# EAGLE design L293DShield (EAGLE 5.09)
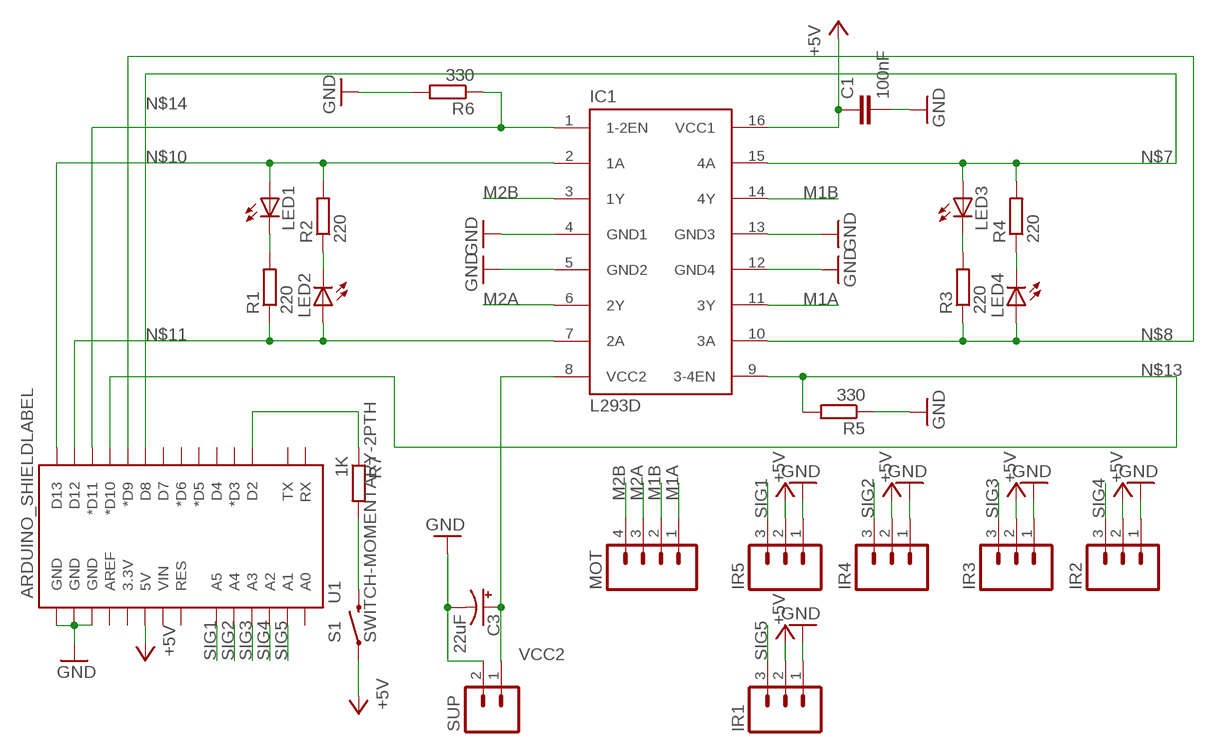
[diagram p0: schematic, sheet 1]

## Parts
C1  100nF  CAPPTH2  [CAP-PTH-SMALL2]
C3  22uF  CAP_POLPTH2  [CPOL-RADIAL-10UF-25V]
IC1  L293D  [DIL16]
IR1  M03PTH  [1X03]
IR2  M03PTH  [1X03]
IR3  M03PTH  [1X03]
IR4  M03PTH  [1X03]
IR5  M03PTH  [1X03]
LED1  LED3MM  [LED3MM]
LED2  LED3MM  [LED3MM]
LED3  LED3MM  [LED3MM]
LED4  LED3MM  [LED3MM]
MOT  M04PTH  [1X04]
R1  220  R-EU_0204/5  [0204/5]
R2  220  R-EU_0204/5  [0204/5]
R3  220  R-EU_0204/5  [0204/5]
R4  220  R-EU_0204/5  [0204/5]
R5  330  R-EU_0204/5  [0204/5]
R6  330  R-EU_0204/5  [0204/5]
R7  1K  R-EU_0204/5  [0204/5]
S1  SWITCH-MOMENTARY-2PTH  [TACTILE-PTH]
SUP  M02LOCK  [1X02_LOCK]
U1  ARDUINO_SHIELDLABEL  [DUEMILANOVE_SHIELD]

## Nets
+5V: C1.1 IC1.16(VCC1) IR1.2 IR2.2 IR3.2 IR4.2 IR5.2 S1.1 U1.5V
GND: C1.2 C3.2(-) IC1.4(GND1) IC1.5(GND2) IC1.12(GND4) IC1.13(GND3) IR1.1 IR2.1 IR3.1 IR4.1 IR5.1 R5.1 R6.2 SUP.2 U1.GND@0(GND) U1.GND@1(GND) U1.GND@2(GND)
M1A: IC1.11(3Y) MOT.1
M1B: IC1.14(4Y) MOT.2
M2A: IC1.6(2Y) MOT.3
M2B: IC1.3(1Y) MOT.4
N$1: LED1.K(C) R1.2
N$2: LED2.K(C) R2.1
N$3: LED3.K(C) R3.2
N$4: LED4.K(C) R4.1
N$5: R7.2 S1.3
N$6: R7.1 U1.D2
N$7: IC1.15(4A) LED3.A R4.2 U1.D8
N$8: IC1.10(3A) LED4.A R3.1 U1.D9(*D9)
N$10: IC1.2(1A) LED1.A R2.2 U1.D13
N$11: IC1.7(2A) LED2.A R1.1 U1.D12
N$13: IC1.9(3-4EN) R5.2 U1.D10(*D10)
N$14: IC1.1(1-2EN) R6.1 U1.D11(*D11)
SIG1: IR5.3 U1.A5
SIG2: IR4.3 U1.A4
SIG3: IR3.3 U1.A3
SIG4: IR2.3 U1.A2
SIG5: IR1.3 U1.A1
VCC2: C3.1(+) IC1.8(VCC2) SUP.1
Unconnected: U1.3.3V U1.A0 U1.AREF U1.D3(*D3) U1.D4 U1.D5(*D5) U1.D6(*D6) U1.D7 U1.RES U1.RX U1.TX U1.VIN

## Library data of the parts
C1 = SparkFun:CAP: Capacitor Standard 0603 ceramic capacitor, and 0.1" leaded capacitor.
C3 = SparkFun:CAP_POL: Capacitor Polarized These are standard SMD and PTH capacitors. Normally 10uF, 47uF, and 100uF in electrolytic and tantalum varieties. Always verify the external diameter of the through hole cap, it varies with capacity, voltage, and manufacturer. The EIA devices should be standard.
IC1 = st-microelectronics:L293D: PUSH-PULL 4 CHANNEL DRIVER
IR1-IR5 = SparkFun:M03: Header 3 Standard 3-pin 0.1" header. Use with straight break away headers (SKU : PRT-00116), right angle break away headers (PRT-00553), swiss pins (PRT-00743), machine pins (PRT-00117), and female headers (PRT-00115). Molex polarized connector foot print use with SKU : PRT-08232 with associated crimp pins and housings.
LED1-LED4 = led:LED: LED OSRAM: - CHIPLED LG R971, LG N971, LY N971, LG Q971, LY Q971, LO R971, LY R971 LH N974, LH R974 LS Q976, LO Q976, LY Q976 LO Q996 - Hyper CHIPLED LW Q18S LB Q993, LB Q99A, LB R99A - SideLED LS A670, LO A670, LY A670, LG A670, LP A670 LB A673, LV A673, LT A673, LW A673 LH A674 LY A675 LS A676, LA A676, LO A676, LY A676, LW A676 LS A679, LY A679, LG A679 - Hyper Micro SIDELED® LS Y876, LA Y876, LO Y876, LY Y876 LT Y87S - SmartLED LW L88C, LW L88S LB L89C, LB L89S, LG L890 LS L89K, LO L89K, LY L89K LS L896, LA L896, LO L896, LY L896 - TOPLED LS T670, LO T670, LY T670, LG T670, LP T670 LSG T670, LSP T670, LSY T670, LOP T670, LYG T670 LG T671, LOG T671, LSG T671 LB T673, LV T673, LT T673, LW T673 LH T674 LS T676, LA T676, LO T676, LY T676, LB T676, LH T676, LSB T676, LW T676 LB T67C, LV T67C, LT T67C, LS T67K, LO T67K, LY T67K, LW E67C LS E67B, LA E67B, LO E67B, LY E67B, LB E67C, LV E67C, LT E67C LW T67C LS T679, LY T679, LG T679 LS T770, LO T770, LY T770, LG T770, LP T770 LB T773, LV T773, LT T773, LW T773 LH T774 LS E675, LA E675, LY E675, LS T675 LS T776, LA T776, LO T776, LY T776, LB T776 LHGB T686 LT T68C, LB T68C - Hyper Mini TOPLED® LB M676 - Mini TOPLED Santana® LG M470 LS M47K, LO M47K, LY M47K Source: http://www.osram.convergy.de LUXEON: - LUMILED® LXK2-PW12-R00, LXK2-PW12-S00, LXK2-PW14-U00, LXK2-PW14-V00 LXK2-PM12-R00, LXK2-PM12-S00, LXK2-PM14-U00 LXK2-PE12-Q00, LXK2-PE12-R00, LXK2-PE12-S00, LXK2-PE14-T00, LXK2-PE14-U00 LXK2-PB12-K00, LXK2-PB12-L00, LXK2-PB12-M00, LXK2-PB14-N00, LXK2-PB14-P00, LXK2-PB14-Q00 LXK2-PR12-L00, LXK2-PR12-M00, LXK2-PR14-Q00, LXK2-PR14-R00 LXK2-PD12-Q00, LXK2-PD12-R00, LXK2-PD12-S00 LXK2-PH12-R00, LXK2-PH12-S00 LXK2-PL12-P00, LXK2-PL12-Q00, LXK2-PL12-R00 Source: www.luxeon.com KINGBRIGHT: KA-3528ASYC Source: www.kingbright.com
MOT = SparkFun:M04: Header 4 Standard 4-pin 0.1" header. Use with straight break away headers (SKU : PRT-00116), right angle break away headers (PRT-00553), swiss pins (PRT-00743), machine pins (PRT-00117), and female headers (PRT-00115). Molex polarized connector foot print use with SKU : PRT-08231 with associated crimp pins and housings.
R1-R7 = resistor:R-EU_: RESISTOR, European symbol
S1 = SparkFun:SWITCH-MOMENTARY-2
SUP = SparkFun:M02: Header 2 Standard 2-pin 0.1" header. Use with straight break away headers (SKU : PRT-00116), right angle break away headers (PRT-00553), swiss pins (PRT-00743), machine pins (PRT-00117), and female headers (PRT-00115). Molex polarized connector foot print use with SKU : PRT-08233 with associated crimp pins and housings.
U1 = SparkFun:ARDUINO_SHIELD

## Board
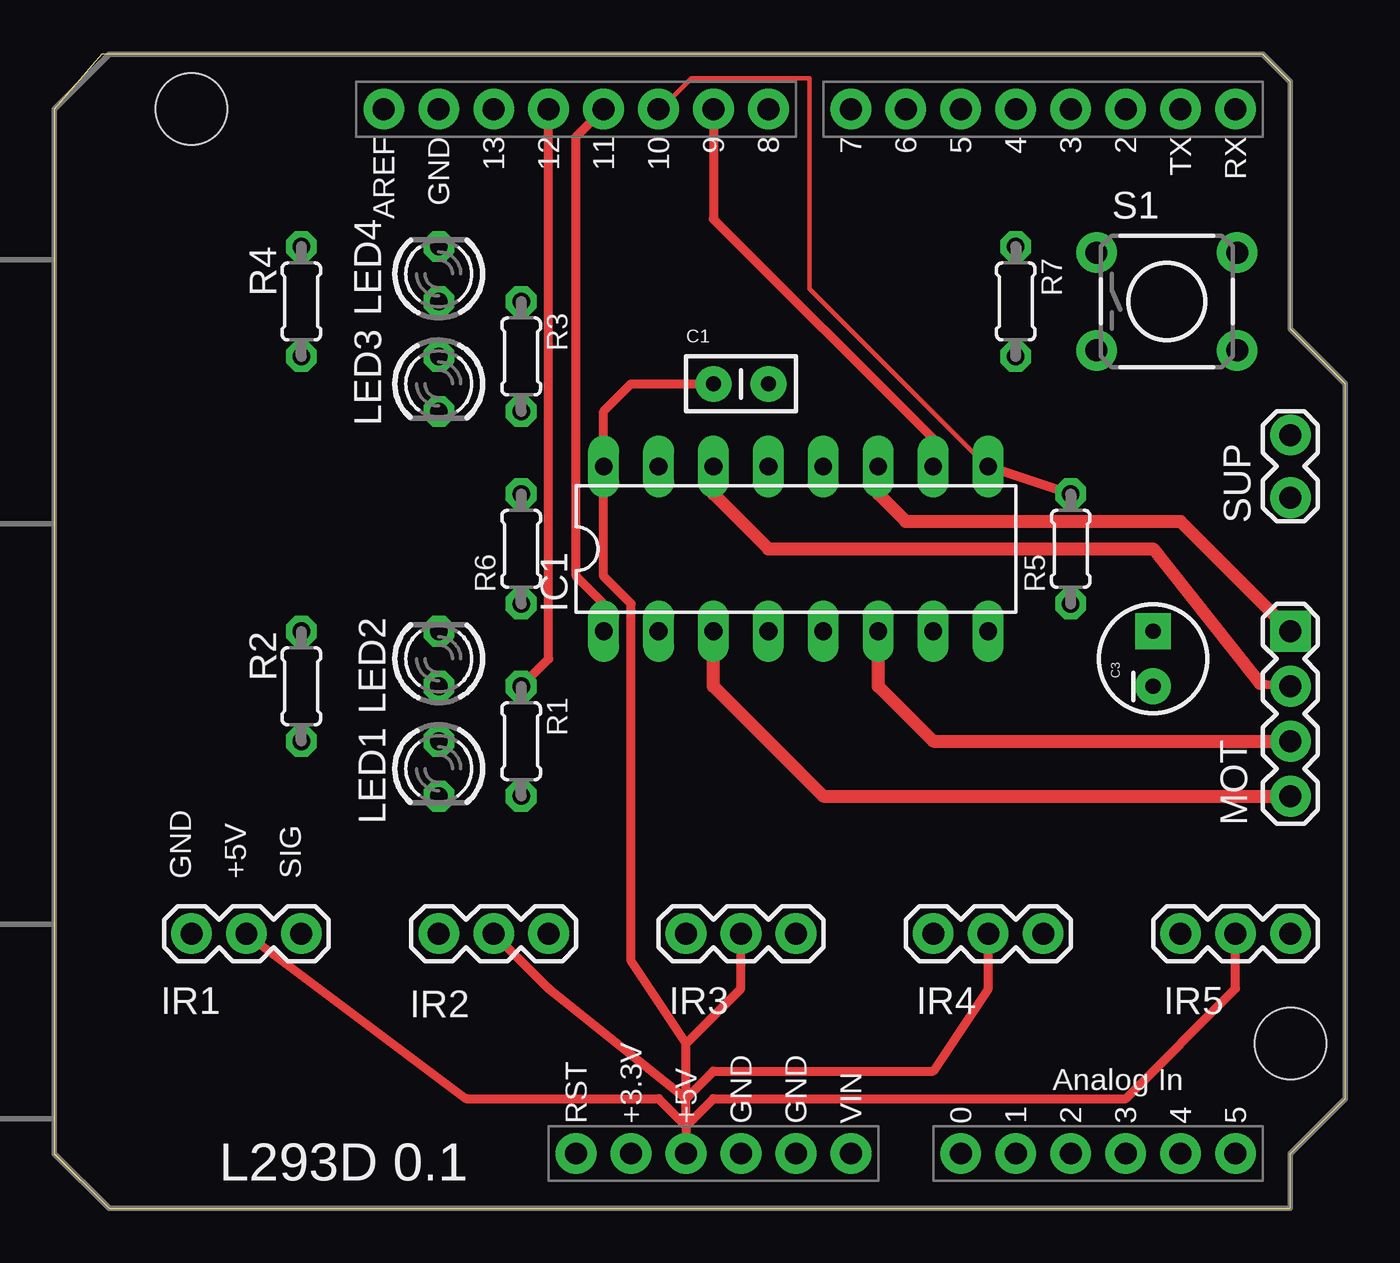
[diagram p1: board, top side]
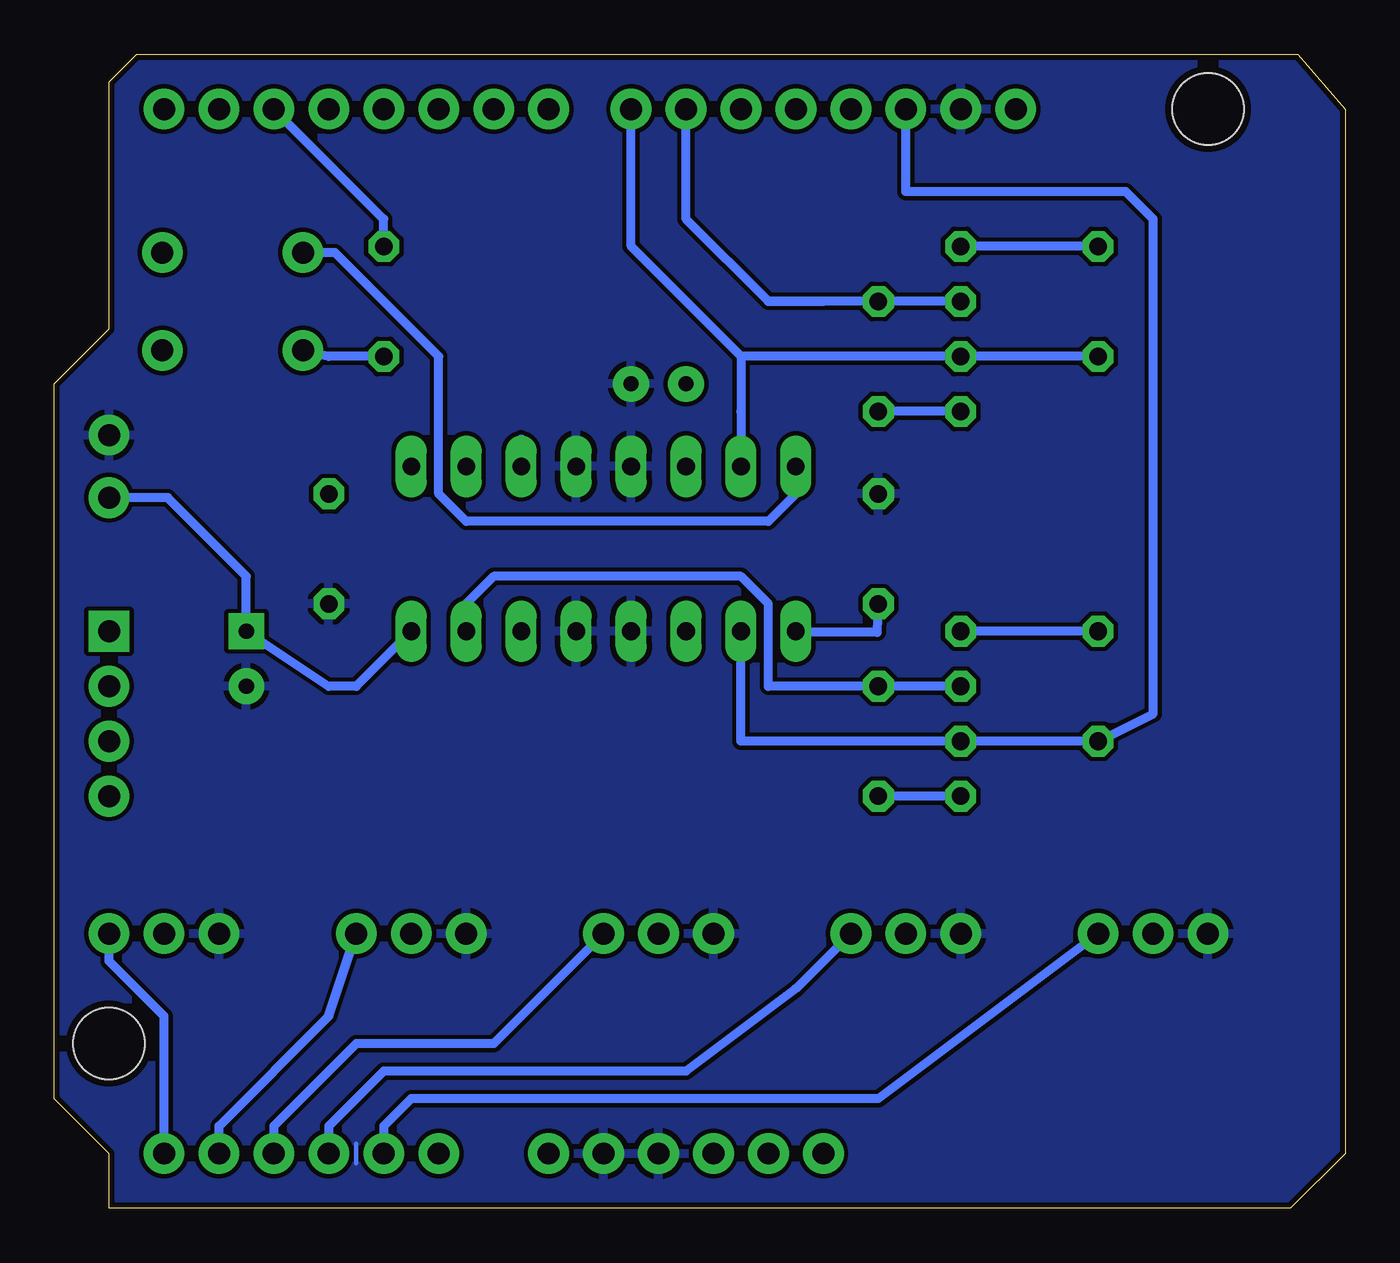
[diagram p2: board, bottom side, seen from below]

Size 59.69 x 53.34 mm. Coordinates in mm from the lower left corner, seen from the top.
Outline: 0,2.54 2.54,0 57.15,0 57.15,2.54 59.69,5.08 59.69,38.1 57.15,40.64 57.15,52.07 55.88,53.34 54.28,53.34 2.21,53.33 0,50.79 0,2.54
Copper layers (1*16): Top 0.035mm / dielectric 1.5mm / Bottom 0.035mm
Design rules "SparkFun": minimum track width 8mil, minimum drill 20mil, track to track 8mil, track to pad 8mil, pad to pad 8mil, via to via 8mil, smd to smd 8mil, copper to edge 10mil, drill to drill 8mil, minimum pad ring 12mil, minimum via ring 10mil, stop-mask expansion 4mil, vias tented up to drill 25mil, thermal gap 10mil

### Footprints (pad centres in the part's own frame; a part is rotated, then mirrored left to right if it is on the bottom)
CAP-PTH-SMALL2 = drill 0.7 pad 1.651 round: 1 0,0; 2 2.54,0
CPOL-RADIAL-10UF-25V = drill 0.7 pad 1.651 square: 1 1.27,0 | drill 0.7 pad 1.651 round: 2 -1.27,0
DIL16 = drill 0.813 long: 1 -8.89,-3.81; 2 -6.35,-3.81; 3 -3.81,-3.81; 4 -1.27,-3.81; 5 1.27,-3.81; 6 3.81,-3.81; 7 6.35,-3.81; 8 8.89,-3.81; 9 8.89,3.81; 10 6.35,3.81; 11 3.81,3.81; 12 1.27,3.81; 13 -1.27,3.81; 14 -3.81,3.81; 15 -6.35,3.81; 16 -8.89,3.81
1X03 = drill 1.016 pad 1.88 round: 1 0,0; 2 2.54,0; 3 5.08,0
LED3MM = drill 0.813 octagon: A -1.27,0; K 1.27,0
1X04 = drill 1.016 pad 1.88 square: 1 0,0 | drill 1.016 pad 1.88 round: 2 2.54,0; 3 5.08,0; 4 7.62,0
0204/5 = drill 0.813 octagon: 1 -2.54,0; 2 2.54,0
TACTILE-PTH = drill 1.016 pad 1.88 round: 1 -3.251,2.261; 2 3.251,2.261; 3 -3.251,-2.261; 4 3.251,-2.261
1X02_LOCK = drill 1.016 pad 1.88 round: 1 -0.178,0; 2 2.718,0
DUEMILANOVE_SHIELD = drill 1.016 pad 1.88 round: 3.3V 50.8,26.67; 5V 50.8,29.21; A0 50.8,41.91; A1 50.8,44.45; A2 50.8,46.99; A3 50.8,49.53; A4 50.8,52.07; A5 50.8,54.61; AREF 2.54,15.24; D2 2.54,49.53; D3 2.54,46.99; D4 2.54,44.45; D5 2.54,41.91; D6 2.54,39.37; D7 2.54,36.83; D8 2.54,33.02; D9 2.54,30.48; D10 2.54,27.94; D11 2.54,25.4; D12 2.54,22.86; D13 2.54,20.32; GND@0 50.8,31.75; GND@1 50.8,34.29; GND@2 2.54,17.78; RES 50.8,24.13; RX 2.54,54.61; TX 2.54,52.07; VIN 50.8,36.83 | hole 3.302: 45.72,57.15; 2.54,6.35

### Placement (x,y rotation side)
C1  30.48,38.1 0 top
C3  50.8,25.4 90 top
IC1  34.29,30.48 0 top
IR1  6.35,12.7 0 top
IR2  17.78,12.7 0 top
IR3  29.21,12.7 0 top
IR4  40.64,12.7 0 top
IR5  52.07,12.7 0 top
LED1  17.78,20.32 270 top
LED2  17.78,25.4 90 top
LED3  17.78,38.1 270 top
LED4  17.78,43.18 90 top
MOT  57.15,26.67 270 top
R1  21.59,21.59 270 top
R2  11.43,24.13 270 top
R3  21.59,39.37 270 top
R4  11.43,41.91 270 top
R5  46.99,30.48 90 top
R6  21.59,30.48 90 top
R7  44.45,41.91 270 top
S1  51.44,41.91 0 top
SUP  57.15,33.02 90 top
U1  0,53.34 270 top

### Tracks (layer width: path | path; a pad name or v marks a point on that pad's centre or on a via)
+5V
  Top 0.406: IR1.2 19.05,5.08 27.94,5.08 29.21,3.81 | IR2.2 22.86,10.16 29.21,5.08 | 29.21,3.81 U1.5V | 29.21,3.81 29.21,5.08 | IR5.2 54.61,10.16 49.53,5.08 30.48,5.08 29.21,3.81 | IR4.2 43.18,10.16 40.64,6.35 30.48,6.35 29.21,5.08 | C1.1 26.67,38.1 25.4,36.83 IC1.16 25.4,29.21 26.67,27.94 26.67,11.43 29.21,7.62 | 29.21,5.08 29.21,7.62 | IR3.2 31.75,10.16 29.21,7.62
  Bottom 0.406: S1.1 46.71,44.17 41.91,39.37 41.91,33.02 40.64,31.75 26.67,31.75 25.4,33.02 IC1.16
GND
  Bottom 0.203: 45.72,2.99 45.72,2.85 45.72,2.23 45.72,2.09
  pour Bottom: -1.27,53.34 -1.27,-1.27 39.37,0 63.5,-1.27 62.23,11.43 62.23,53.34
M1A
  Top 0.61: MOT.1 52.07,31.75 39.37,31.75 38.1,33.02 IC1.11
  Bottom 0.406: IC1.11 38.1,35.56
M1B
  Top 0.406: 55.75,24.26 MOT.2
  Top 0.61: 55.75,24.26 50.8,30.48 33.02,30.48 30.48,33.02 IC1.14
M2A
  Top 0.61: MOT.3 40.64,21.59 38.1,24.13 IC1.6
M2B
  Top 0.61: MOT.4 35.56,19.05 30.48,24.13 IC1.3
N$1
  Bottom 0.406: LED1.K R1.2
N$2
  Bottom 0.406: R2.1 LED2.K
N$3
  Bottom 0.406: LED3.K R3.2
N$4
  Bottom 0.406: R4.1 LED4.K
N$5
  Bottom 0.406: R7.2 46.99,39.37 48.26,39.57 S1.3
N$6
  Bottom 0.406: R7.1 44.45,45.72 U1.D2
N$7
  Bottom 0.406: 27.94,39.37 LED3.A R4.2 | U1.D8 33.02,44.45 27.94,39.37 | IC1.15 27.94,36.83 27.94,39.37
N$8
  Top 0.406: IC1.10 40.64,35.56 30.48,45.72 U1.D9
  Bottom 0.406: 26.67,41.91 R3.1 LED4.A | 26.67,41.91 24.13,41.91 | 26.67,41.91 30.48,45.72 U1.D9
N$10
  Bottom 0.406: IC1.2 27.94,21.59 LED1.A R2.2 8.89,22.86 8.89,45.72 10.16,46.99 20.32,46.99 U1.D13
N$11
  Top 0.406: U1.D12 22.86,25.4 R1.1
  Bottom 0.406: IC1.7 40.64,27.94 39.37,29.21 27.94,29.21 26.67,27.94 26.67,24.13 R1.1 LED2.A
N$13
  Top 0.203: 43.28,34.34 IC1.9 43.08,34.34 34.92,42.49 34.92,52.22 29.46,52.22 28.04,50.8 U1.D10
  Top 0.406: IC1.9 R5.2
N$14
  Top 0.406: IC1.1 25.4,27.94 24.13,29.21 24.13,49.53 U1.D11
  Bottom 0.203: R6.1 21.74,26.62 | 25.4,26.62 IC1.1
  Bottom 0.406: 25.4,26.62 21.64,26.62 R6.1
SIG1
  Bottom 0.406: U1.A5 54.61,8.89 57.15,11.43 IR5.3
SIG2
  Bottom 0.406: U1.A4 52.07,3.81 46.99,8.89 IR4.3
SIG3
  Bottom 0.406: U1.A3 49.53,3.81 45.72,7.62 39.37,7.62 IR3.3
SIG4
  Bottom 0.406: U1.A2 46.99,3.81 44.45,6.35 30.48,6.35 25.4,10.16 IR2.3
SIG5
  Bottom 0.406: IR1.3 21.59,5.08 43.18,5.08 44.45,3.81 U1.A1
VCC2
  Bottom 0.406: SUP.1 54.43,32.84 50.8,29.21 C3.1 46.99,24.13 45.72,24.13 IC1.8

### Text on the board
tNames: GND | +5V | SIG | L293D 0.1